# Altium project battery_module_2c.PrjPcb
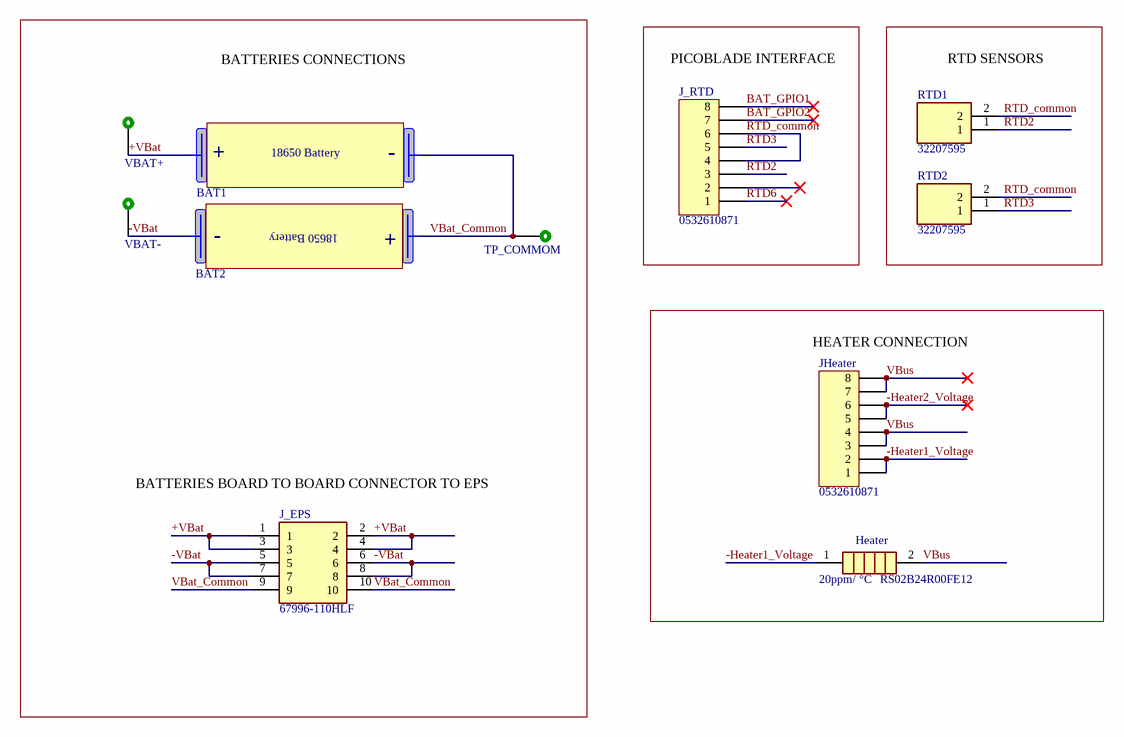
[diagram p0: connectors.SchDoc]
1 sheet, 11 parts. Net scope: global (net labels, ports and power ports of the same name join across sheets).
Board file: board_layout.PcbDoc

## Sheet connectors.SchDoc: Batteries and connectors
size A4; Revision: v0.2; ProjectCode: BATC2

### Parts
BAT1  18650 Battery contact strip slot  [BATTERY_18650_STRIP_CONTACT]  (value not drawn)  (no BOM)
BAT2  18650 Battery contact strip slot  [BATTERY_18650_STRIP_CONTACT]  (value not drawn)  (no BOM)
Heater  RS02B24R00FE12  Temperature Coefficient: 20ppm/ °C  [RESAD3322W86L1422D475]
J_EPS  67996-110HLF  [HDRV10W64P254_2X5_1270X502X521P]
J_RTD  0532610871  [PICOBLADE 8PIN RIGHT ANGLE]
JHeater  0532610871  [PICOBLADE 8PIN RIGHT ANGLE]
RTD1  32207595  [THRMC3216X70N]
RTD2  32207595  [THRMC3216X70N]
TP_COMMOM  TEST_POINT  [Test_Point]  (value not drawn)  (no BOM)
VBAT+  TEST_POINT  [Test_Point]  (value not drawn)  (no BOM)
VBAT-  TEST_POINT  [Test_Point]  (value not drawn)  (no BOM)

### Blocks framed on the sheet
PICOBLADE INTERFACE: J_RTD
RTD SENSORS: RTD1 RTD2
HEATER CONNECTION: Heater JHeater

### Nets
+VBat: BAT1.+(Positive) J_EPS.1 J_EPS.2 J_EPS.3 J_EPS.4 VBAT+.1
-Heater1_Voltage: Heater.1 JHeater.1 JHeater.2
-Heater2_Voltage: JHeater.5 JHeater.6
-VBat: BAT2.-(Negative) J_EPS.5 J_EPS.6 J_EPS.7 J_EPS.8 VBAT-.1
BAT_GPIO1: J_RTD.8
BAT_GPIO2: J_RTD.7
RTD2: J_RTD.3 RTD1.1
RTD3: J_RTD.5 RTD2.1
RTD6: J_RTD.1
RTD_common: J_RTD.4 J_RTD.6 RTD1.2 RTD2.2
VBat_Common: BAT1.-(Negative) BAT2.+(Positive) J_EPS.9 J_EPS.10 TP_COMMOM.1
VBus: Heater.2 JHeater.3 JHeater.4 JHeater.7 JHeater.8

Not connected (* = marked no-connect by the designer): J_RTD 2*

### Notes on the sheet
- BATTERIES CONNECTIONS
- (near J_EPS) BATTERIES BOARD TO BOARD CONNECTOR TO EPS
- Project:
- SpaceLab - Federal University of Santa Catarina
- Title:
- Designed by:
- Project Code:
- Date:
- Revision:
- Sheet
- of
- Size:
- A4
- (in symbol 18650_Battery_contact_strip_slot) 18650 Battery

### Library data of the parts
BAT1 BAT2 = 18650_Battery_contact_strip_slot: Slot using stip contact for 18650 batterie
Heater = RS02B24R00FE12: Wirewound Resistors - Through Hole 3watts 24ohms 1%; Manufacturer_Name: Vishay; Resistance: 24R; Power rating: 3W; Datasheet Link: https://www.vishay.com/docs/30204/rsns.pdf; Manufacturer_Part_Number: RS02B24R00FE12; Arrow Part Number: RS02B24R00FE12; Partnumber: RS02B24R00FE12
J_EPS = 67996-110HLF: Headers & Wire Housings 2X5P UNSHRD HDR 30 microinch gold; Manufacturer_Name: SAMTEC; Height: 5.84mm; Manufacturer_Part_Number: 67996-110HLF; Mouser Part Number: 649-67996-110HLF; Mouser Price/Stock: https://br.mouser.com/ProductDetail/?qs=zh4O8xspOuxgf2RA9jR3ZQ%3D%3D; Partnumber: 67996-110HLF
J_RTD JHeater = 0532610871: PicoBlade 8 Position Right Angle Connector Header Surface Mount 0.049" (1.25mm); PartNumber: 53261-0871; Manufacturer: Molex; Contact Resistance: 20mR; Current Rating: 1A; Gender: Male; Glow Wire Compliant: Non-compliant; Insulation Resistance: 100MR; Number of Circuits: 8; Voltage Rating (AC): 125V; LatestRevisionDate: 17-Jul-2002; LatestRevisionNote: Re-released for DXP Platform.; Publisher: Altium Limited; Color: Beige; ComponentLink1Description: http://uk.rs-online.com/webdocs/13c4/0900766b813c44c3.pdf?src-supplier=RSComponents; ComponentLink1URL: http://uk.rs-online.com/webdocs/13c4/0900766b813c44c3.pdf?src-supplier=RSComponents; ComponentLink2Description: http://www.farnell.com/datasheets/1632136.pdf?src-supplier=Element14; ComponentLink2URL: http://www.farnell.com/datasheets/1632136.pdf?src-supplier=Element14; ComponentLink3Description: http://www.farnell.com/datasheets/1862905.pdf?src-supplier=Element14; ComponentLink3URL: http://www.farnell.com/datasheets/1862905.pdf?src-supplier=Element14; ComponentLink4Description: http://www.onlinecomponents.com/productFiles/mf-MOL/0532610871_pcb_headers.pdf?src-supplier=Onlinecomponents.com; ComponentLink4URL: http://www.onlinecomponents.com/productFiles/mf-MOL/0532610871_pcb_headers.pdf?src-supplier=Onlinecomponents.com; ComponentLink5Description: http://www.jameco.com/Jameco/Products/ProdDS/1932580.pdf?src-supplier=Jameco; ComponentLink5URL: http://www.jameco.com/Jameco/Products/ProdDS/1932580.pdf?src-supplier=Jameco; ComponentLink6Description: https://www.distrelec.biz/Web/Downloads/74/_e/gh116861-116874_e.pdf?mime=application%2Fpdf&src-supplier=Distrelec; ComponentLink6URL: https://www.distrelec.biz/Web/Downloads/74/_e/gh116861-116874_e.pdf?mime=application%2Fpdf&src-supplier=Distrelec; ComponentLink7Description: http://www.mouser.com/ds/2/276/0532610871_PCB_HEADERS-171054.pdf?src-supplier=Mouser; ComponentLink7URL: http://www.mouser.com/ds/2/276/0532610871_PCB_HEADERS-171054.pdf?src-supplier=Mouser; ComponentLink8Description: http://www.molex.com/webdocs/datasheets/pdf/en-us/0532610871_PCB_HEADERS.pdf?src-supplier=Avnet+Europe; ComponentLink8URL: http://www.molex.com/webdocs/datasheets/pdf/en-us/0532610871_PCB_HEADERS.pdf?src-supplier=Avnet+Europe; ComponentLink9Description: http://www.farnell.com/datasheets/1841157.pdf?src-supplier=Farnell; ComponentLink9URL: http://www.farnell.com/datasheets/1841157.pdf?src-supplier=Farnell; ComponentLink10Description: http://www.molex.com/webdocs/datasheets/pdf/en-us/0532610871_PCB_HEADERS.pdf?src-supplier=Avnet; ComponentLink10URL: http://www.molex.com/webdocs/datasheets/pdf/en-us/0532610871_PCB_HEADERS.pdf?src-supplier=Avnet; Contact Material: Bronze,Brass,Tin; Contact Plating: Tin; Flammability Rating: UL94 V-0; Housing Material: Thermoplastic; Lead Free: Lead Free; Lead Pitch: 1.25mm; Manufacturer Part Number: 53261-0871; Max Operating Temperature: 85°C; Min Operating Temperature: -40°C; Mount: Surface Mount; Number of Contacts: 8; Number of Positions: 8; Number of Rows: 1; Orientation: Right Angle; Package Quantity: 1000; Packaging: Tape and Reel; Pitch: 1.25mm; Pricing 1: 1=1.31, 10=1.15, 100=0.991, 500=0.832, 1000=0.42, 2000=0.367 (USD); Pricing 2: 1=1.64, 10=1.487, 100=1.2749, 500=1.0624 (USD); Radiation Hardening: No; REACH SVHC: Unknown; Stock 1: 13055; Stock 2: 24265; Supplier 1: Mouser; Supplier 2: Digi-Key; Supplier Part Number 1: 538-53261-0871; Supplier Part Number 2: WM7626CT-ND; Termination: Solder; Voltage Rating (DC): 125V; Voltage Rating: 125V; Working Voltage: 125V
RTD1 RTD2 = 32207595: 1 kOhms RTD Platinum (Pt) ±0.3% 3850ppm/°C 1206 (3216 Metric); Manufacturer_Name: Heraeus Nexensos; Datasheet Link: https://componentsearchengine.com/Datasheets/1/32207595.pdf; Height: 0.7mm; Manufacturer_Part_Number: 32207595; Arrow Part Number: 32207595; Mouser Part Number: 956-32207595; Mouser Price/Stock: https://www.mouser.co.uk/ProductDetail/Heraeus-Nexensos/32207595?qs=MQgg6%252BVqoaPj6oznJNIlwg%3D%3D; Partnumber: 32207595
TP_COMMOM VBAT+ VBAT- = TEST_POINT: Test Point